# Altium schematic sheet 24V_to_5V_regulator.SchDoc
size A4
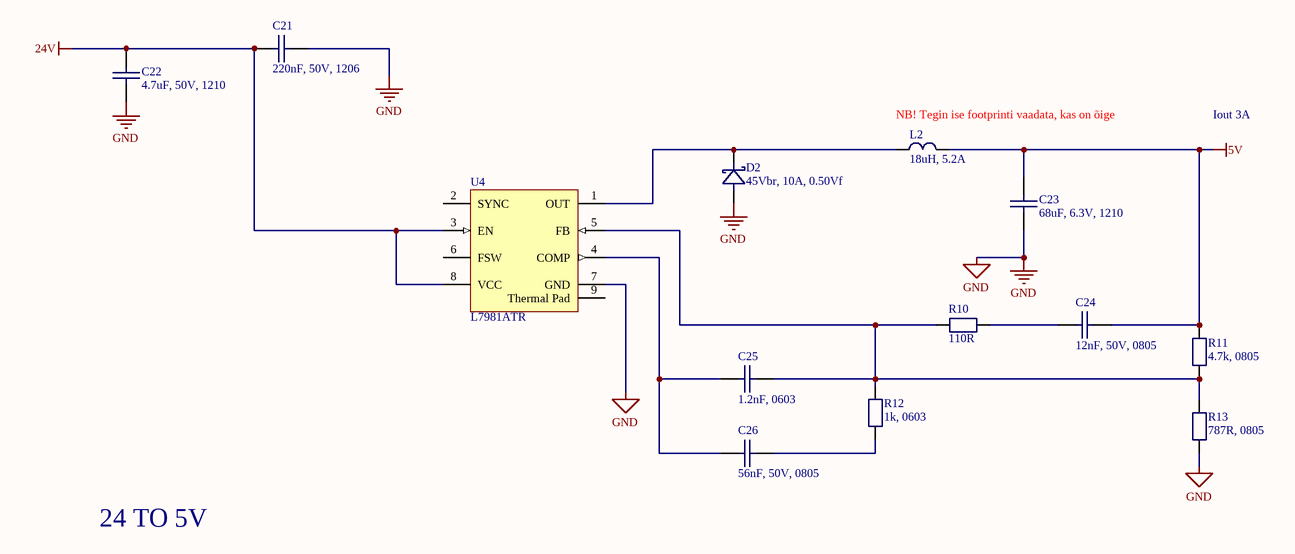
[diagram p0: 24V_to_5V_regulator.SchDoc]

## Parts
C21  220nF, 50V, 1206  [3216 [1206] CAP]
C22  4.7uF, 50V, 1210  [3225 [1210] CAP]
C23  68uF, 6.3V, 1210  [3225 [1210] CAP]
C24  12nF, 50V, 0805  [2012 [0805] CAP]
C25  1.2nF, 0603  [1608 [0603] CAP]
C26  56nF, 50V, 0805  [2012 [0805] CAP]
D2  45Vbr, 10A, 0.50Vf  [DPAK (TO252-3)]
L2  18uH, 5.2A  [SRR12xx IND]
R10  110R  [2012 [0805] RES]
R11  4.7k, 0805  [2012 [0805] RES]
R12  1k, 0603  [1608 [0603] RES]
R13  787R, 0805  [2012 [0805] RES]
U4  L7981ATR  [HSOP8-D1_N]

## Nets
5V: C23.1 C24.1 L2.2 R11.2
24V: C21.2 C22.1 U4.3(EN) U4.8(VCC)
GND: C21.1 C22.2 C23.2 D2.2 R13.1 U4.7(GND)
NetC24_2: C24.2 R10.2
NetC25_1: C25.1 R10.1 R11.1 R12.2 R13.2 U4.5(FB)
NetC25_2: C25.2 C26.2 U4.4(COMP)
NetC26_1: C26.1 R12.1
NetD2_1: D2.1 L2.1 U4.1(OUT)

Not connected (* = marked no-connect by the designer): U4 2(SYNC) 6(FSW) 9(Thermal_Pad)

## Notes on the sheet
- (near L2) NB! Tegin ise footprinti vaadata, kas on õige
- Iout 3A
- 24 TO 5V

## Library data of the parts
C21 = Capacitor: Product Name: CM316X7R224K50AT; Manufacturer: *; Supplier Number: 1216553; Supplier: Farnell; Notes: *
C22 = Capacitor: Product Name: GRM32ER71H475KA88L; Manufacturer: *; Supplier Number: 1828841; Supplier: Farnell; Notes: *
C23 = Capacitor: Product Name: C3225X5R0J686M200AC; Manufacturer: *; Supplier Number: 2526283; Supplier: Farnell; Notes: *
C24 = Capacitor: Product Name: GRM2195C1H123JA01D; Manufacturer: *; Supplier Number: *; Supplier: Mouser; Notes: *
C25 = Capacitor: Product Name: 06035A122JAT2A; Manufacturer: *; Supplier Number: *; Supplier: Mouser; Notes: *
C26 = Capacitor: Product Name: MC0805B563K500CT; Manufacturer: *; Supplier Number: 1759261; Supplier: Farnell; Notes: *
D2 = Diode Shottky: pin to pad: 1>2 2>3; Product Name: STPS1045B; Manufacturer: *; Supplier Number: 9907297; Supplier: Farnell; Notes: *
L2 = Inductor: Product Name: 744770118; Manufacturer: *; Supplier Number: 2082594; Supplier: Farnell; Notes: *
R10-R13 = Resistor: Manufacturer: *; Product Name: *; Supplier Number: *; Supplier: Farnell; Notes: *
U4 = L7981ATR: 3 A step-down switching regulator, 8-Pin HSOP, Tape and Reel; DatasheetVersion: Jul-2010; PackageVersion: 2010; PackageReference: HSOP8-D1; PackageDescription: 8-Pin Small Outline Integrated Circuit 1.27 mm Pitch; ComponentLink1Description: Manufacturer URL; ComponentLink1URL: http://www.st.com; ComponentLink2Description: Datasheet; ComponentLink2URL: http://www.st.com/internet/com/TECHNICAL_RESOURCES/TECHNICAL_LITERATURE/DATASHEET/CD00217474.pdf; Supplier: *; Supplier Number: *